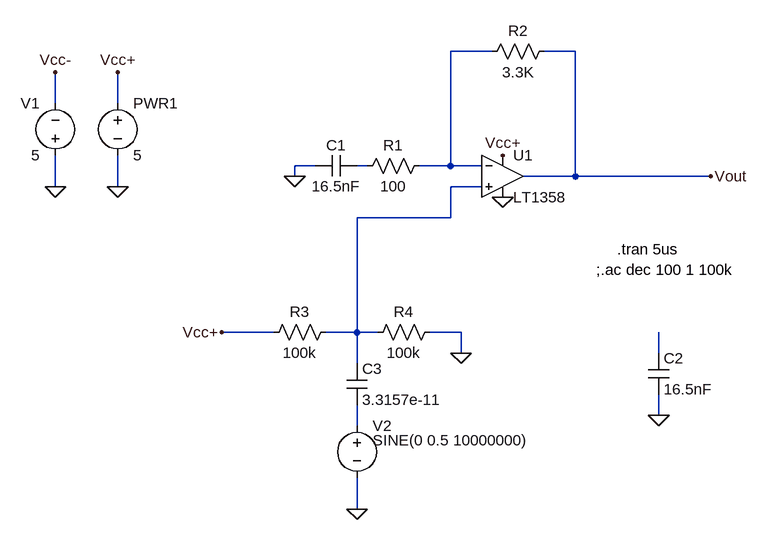
[diagram p0: schematic IQAmpMahirAttemptBodePlotWrong.asc]
IQAmpMahirAttemptBodePlotWrong.asc, the LTspice schematic file:
Version 4
SHEET 1 980 864
WIRE 576 48 512 48
WIRE 704 48 656 48
WIRE -96 128 -96 80
WIRE 0 128 0 80
WIRE 304 224 272 224
WIRE 384 224 368 224
WIRE 512 224 512 48
WIRE 512 224 464 224
WIRE 560 224 512 224
WIRE 272 240 272 224
WIRE 704 240 704 48
WIRE 704 240 624 240
WIRE 912 240 704 240
WIRE -96 256 -96 208
WIRE 0 256 0 208
WIRE 560 256 512 256
WIRE 512 304 512 256
WIRE 512 304 368 304
WIRE 240 480 160 480
WIRE 368 480 368 304
WIRE 368 480 320 480
WIRE 400 480 368 480
WIRE 528 480 480 480
WIRE 528 512 528 480
WIRE 832 512 832 480
WIRE 368 528 368 480
WIRE 832 608 832 576
WIRE 368 624 368 592
WIRE 368 752 368 704
FLAG 272 240 0
FLAG 0 80 Vcc+
FLAG 592 208 Vcc+
FLAG 0 256 0
FLAG 832 608 0
FLAG -96 256 0
FLAG -96 80 Vcc-
FLAG 592 272 0
FLAG 160 480 Vcc+
FLAG 528 512 0
FLAG 368 752 0
FLAG 912 240 Vout
SYMBOL Res 480 208 R90
WINDOW 0 0 56 VBottom 2
WINDOW 3 32 56 VTop 2
SYMATTR InstName R1
SYMATTR Value 100
SYMBOL Voltage 0 112 R0
SYMATTR InstName PWR1
SYMATTR Value 5
SYMBOL OpAmps/LT1358 592 176 R0
SYMATTR InstName U1
SYMBOL Res 672 32 R90
WINDOW 0 0 56 VBottom 2
WINDOW 3 32 56 VTop 2
SYMATTR InstName R2
SYMATTR Value 3.3K
SYMBOL Cap 816 512 R0
SYMATTR InstName C2
SYMATTR Value 16.5nF
SYMBOL Voltage -96 224 R180
WINDOW 0 24 96 Left 2
WINDOW 3 24 16 Left 2
SYMATTR InstName V1
SYMATTR Value 5
SYMBOL Res 336 464 R90
WINDOW 0 0 56 VBottom 2
WINDOW 3 32 56 VTop 2
SYMATTR InstName R3
SYMATTR Value 100k
SYMBOL Res 496 464 R90
WINDOW 0 0 56 VBottom 2
WINDOW 3 32 56 VTop 2
SYMATTR InstName R4
SYMATTR Value 100k
SYMBOL Cap 352 528 R0
SYMATTR InstName C3
SYMATTR Value 3.3157e-11
SYMBOL Cap 368 208 R90
WINDOW 0 0 32 VBottom 2
WINDOW 3 32 32 VTop 2
SYMATTR InstName C1
SYMATTR Value 16.5nF
SYMBOL voltage 368 608 R0
WINDOW 3 24 38 Left 2
WINDOW 123 24 118 Left 2
SYMATTR InstName V2
SYMATTR Value SINE(0 0.5 10000000)
TEXT 768 352 Left 2 !.tran 5us
TEXT 736 384 Left 2 !;.ac dec 100 1 100k

The netlist it stands for:
* IQAmpMahirAttemptBodePlotWrong.asc
R1 N001 N002 100
V§PWR1 Vcc+ 0 5
XU1 N003 N001 Vcc+ 0 Vout LT1357  ; LT1358, pins In+ In- V+ V- OUT
R2 Vout N001 3.3K
C2 N004 0 16.5nF
V1 0 Vcc- 5
R3 N003 Vcc+ 100k
R4 0 N003 100k
C3 N003 N005 3.3157e-11
C1 N002 0 16.5nF
V2 N005 0 SINE(0 0.5 10000000)
.tran 5us
;.ac dec 100 1 100k
.lib LTC.lib
.backanno
.end